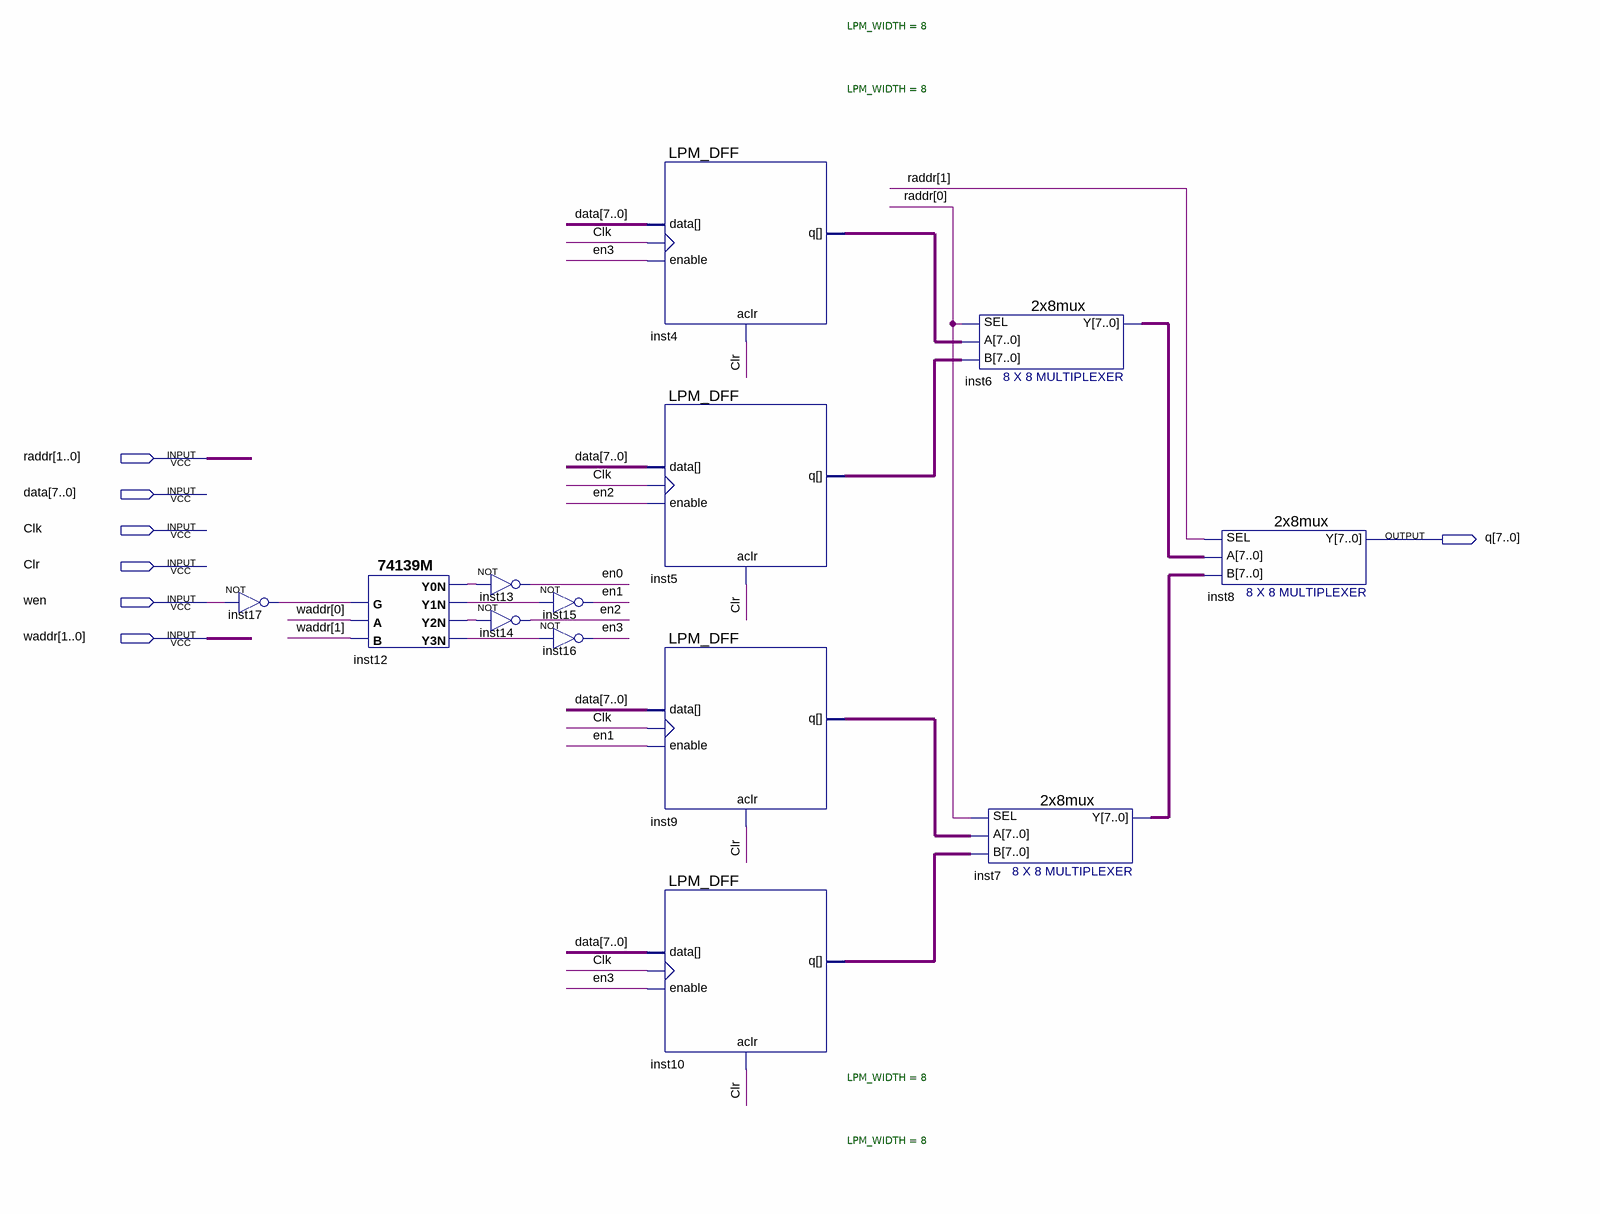
[diagram p0: schematic sheet]
// Quartus schematic 4Rigister8bit.bdf as structural Verilog: 13 symbols, 7 pins
module \4Rigister8bit  (
  input  [1:0] raddr,
  input  [7:0] data,
  input  Clk,
  input  Clr,
  input  wen,
  input  [1:0] waddr,
  output [7:0] q
);

  wire en0, en1, en2, en3, inst12_y0n, inst12_y1n, inst12_y2n, inst12_y3n, inst17_out;
  wire [7:0] inst4_q, inst5_q, inst6_y, inst7_y, inst9_q, inst10_q;

  not inst17 (inst17_out, wen);
  \74139M  inst12 (
    .B(waddr[1]), .A(waddr[0]), .G(inst17_out), .Y3N(inst12_y3n), .Y2N(inst12_y2n), .Y0N(inst12_y0n),
    .Y1N(inst12_y1n));
  not inst13 (en0, inst12_y0n);
  not inst14 (en2, inst12_y2n);
  not inst15 (en1, inst12_y1n);
  not inst16 (en3, inst12_y3n);
  LPM_DFF #(.LPM_WIDTH(8)) inst4 (.aclr(Clr), .clock(Clk), .data(data), .enable(en3), .q(inst4_q));
  LPM_DFF #(.LPM_WIDTH(8)) inst5 (.aclr(Clr), .clock(Clk), .data(data), .enable(en2), .q(inst5_q));
  LPM_DFF #(.LPM_WIDTH(8)) inst9 (.aclr(Clr), .clock(Clk), .data(data), .enable(en1), .q(inst9_q));
  LPM_DFF #(.LPM_WIDTH(8)) inst10 (.aclr(Clr), .clock(Clk), .data(data), .enable(en3), .q(inst10_q));
  \2x8mux  inst6 (.SEL(raddr[0]), .A(inst4_q), .B(inst5_q), .Y(inst6_y));
  \2x8mux  inst7 (.SEL(raddr[0]), .A(inst9_q), .B(inst10_q), .Y(inst7_y));
  \2x8mux  inst8 (.SEL(raddr[1]), .A(inst6_y), .B(inst7_y), .Y(q));
endmodule
